# EAGLE schematic rentalito (EAGLE 6.3)
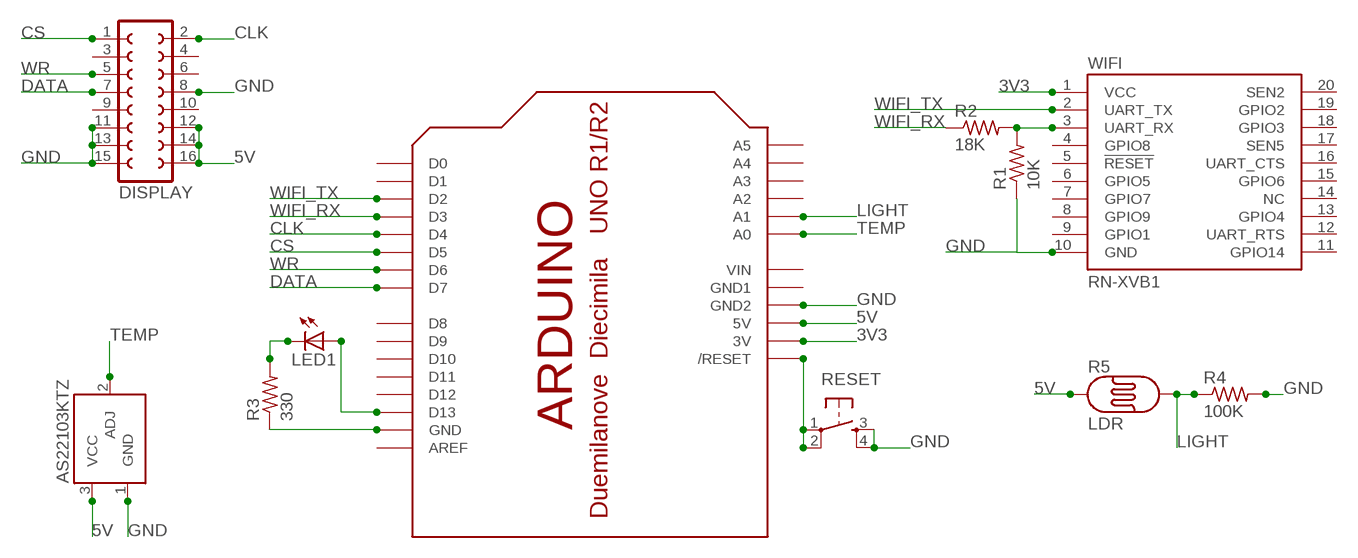
[diagram p0: schematic, sheet 1]

## Parts
AS22103KTZ  TEMPERATURE-SENSOR  [TO-92]
DISPLAY  FE08-2  [FE08-2]
LED1  LED5MM  [LED5MM]
R1  10K  R-US_0204/7  [0204/7]
R2  18K  R-US_0204/7  [0204/7]
R3  330  R-US_0204/7  [0204/7]
R4  100K  R-US_0204/7  [0204/7]
R5  LDR  PHOTOCELLPTH  [PHOTOCELL]
RESET  TAC_SWITCHPTH  [TACTILE-PTH]
U$1  ARDUINOUNO  [ARDUINO]
WIFI  RN-XVB1  [XBEE]

## Nets
3V3: U$1.3V WIFI.1(VCC)
5V: AS22103KTZ.3(VCC) DISPLAY.12 DISPLAY.14 DISPLAY.16 R5.1 U$1.5V
CLK: DISPLAY.2 U$1.D4
CS: DISPLAY.1 U$1.D5
DATA: DISPLAY.7 U$1.D7
GND: AS22103KTZ.1(GND) DISPLAY.8 DISPLAY.11 DISPLAY.13 DISPLAY.15 R1.1 R4.2 RESET.3 RESET.4 U$1.GND2 WIFI.10(GND)
LIGHT: R4.1 R5.2 U$1.A1
N$6: R3.1 U$1.GND
N$12: LED1.A U$1.D13
N$13: R1.2 R2.2 WIFI.3(UART_RX)
N$14: LED1.K(C) R3.2
N$17: RESET.1 RESET.2 U$1.RESET(/RESET)
TEMP: AS22103KTZ.2(ADJ) U$1.A0
WIFI_RX: R2.1 U$1.D3
WIFI_TX: U$1.D2 WIFI.2(UART_TX)
WR: DISPLAY.5 U$1.D6
Unconnected: DISPLAY.3 DISPLAY.4 DISPLAY.6 DISPLAY.9 DISPLAY.10 U$1.A2 U$1.A3 U$1.A4 U$1.A5 U$1.AREF U$1.D0 U$1.D1 U$1.D8 U$1.D9 U$1.D10 U$1.D11 U$1.D12 WIFI.4(GPIO8) WIFI.5(!RESET) WIFI.6(GPIO5) WIFI.7(GPIO7) WIFI.8(GPIO9) WIFI.9(GPIO1) WIFI.11(GPIO14) WIFI.12(UART_RTS) WIFI.13(GPIO4) WIFI.14(NC) WIFI.15(GPIO6) WIFI.16(UART_CTS) WIFI.17(SEN5) WIFI.18(GPIO3) WIFI.19(GPIO2) WIFI.20(SEN2)

## Power pins joined to a net without a drawn wire
GND1: U$1.GND1
VIN: U$1.VIN

## Library data of the parts
AS22103KTZ = SparkFun-Sensors:TEMPERATURE-SENSOR: TO-92 temp sensor
DISPLAY = con-lsta:FE08-2: FEMALE HEADER; OC_FARNELL: unknown; OC_NEWARK: unknown
LED1 = led:LED: LED OSRAM: - CHIPLED LG R971, LG N971, LY N971, LG Q971, LY Q971, LO R971, LY R971 LH N974, LH R974 LS Q976, LO Q976, LY Q976 LO Q996 - Hyper CHIPLED LW Q18S LB Q993, LB Q99A, LB R99A - SideLED LS A670, LO A670, LY A670, LG A670, LP A670 LB A673, LV A673, LT A673, LW A673 LH A674 LY A675 LS A676, LA A676, LO A676, LY A676, LW A676 LS A679, LY A679, LG A679 - Hyper Micro SIDELED® LS Y876, LA Y876, LO Y876, LY Y876 LT Y87S - SmartLED LW L88C, LW L88S LB L89C, LB L89S, LG L890 LS L89K, LO L89K, LY L89K LS L896, LA L896, LO L896, LY L896 - TOPLED LS T670, LO T670, LY T670, LG T670, LP T670 LSG T670, LSP T670, LSY T670, LOP T670, LYG T670 LG T671, LOG T671, LSG T671 LB T673, LV T673, LT T673, LW T673 LH T674 LS T676, LA T676, LO T676, LY T676, LB T676, LH T676, LSB T676, LW T676 LB T67C, LV T67C, LT T67C, LS T67K, LO T67K, LY T67K, LW E67C LS E67B, LA E67B, LO E67B, LY E67B, LB E67C, LV E67C, LT E67C LW T67C LS T679, LY T679, LG T679 LS T770, LO T770, LY T770, LG T770, LP T770 LB T773, LV T773, LT T773, LW T773 LH T774 LS E675, LA E675, LY E675, LS T675 LS T776, LA T776, LO T776, LY T776, LB T776 LHGB T686 LT T68C, LB T68C - Hyper Mini TOPLED® LB M676 - Mini TOPLED Santana® LG M470 LS M47K, LO M47K, LY M47K Source: http://www.osram.convergy.de LUXEON: - LUMILED® LXK2-PW12-R00, LXK2-PW12-S00, LXK2-PW14-U00, LXK2-PW14-V00 LXK2-PM12-R00, LXK2-PM12-S00, LXK2-PM14-U00 LXK2-PE12-Q00, LXK2-PE12-R00, LXK2-PE12-S00, LXK2-PE14-T00, LXK2-PE14-U00 LXK2-PB12-K00, LXK2-PB12-L00, LXK2-PB12-M00, LXK2-PB14-N00, LXK2-PB14-P00, LXK2-PB14-Q00 LXK2-PR12-L00, LXK2-PR12-M00, LXK2-PR14-Q00, LXK2-PR14-R00 LXK2-PD12-Q00, LXK2-PD12-R00, LXK2-PD12-S00 LXK2-PH12-R00, LXK2-PH12-S00 LXK2-PL12-P00, LXK2-PL12-Q00, LXK2-PL12-R00 Source: www.luxeon.com KINGBRIGHT: KA-3528ASYC Source: www.kingbright.com
R1-R4 = resistor:R-US_: RESISTOR, American symbol
R5 = SparkFun-Sensors:PHOTOCELL: CdS photoresistor. This is a low cost way to detect light levels. Resistance decreases with more incoming light. SparkFun SKU: SEN-09088
RESET = SparkFun-Electromechanical:TAC_SWITCH: Momentary Switch Button commonly used for reset or general input. Spark Fun Electronics SKU : COM-00097 SMT- SWCH-08247
U$1 = adafruit:ARDUINO: Arduino Diecimila/Duemilanove Make a shield with ease, this package has all the named pins as well as the two mounting drill holes and an outline of the USB and DC power connector. The outline is on the DIMENSION layer, so if your board house uses it they will cut the outline to match. http://www.ladyada.net/library/pcb/eaglelibrary.html
WIFI = SteveMarple:RN-XV